# EAGLE schematic 7seg247 (EAGLE 6.6.0)
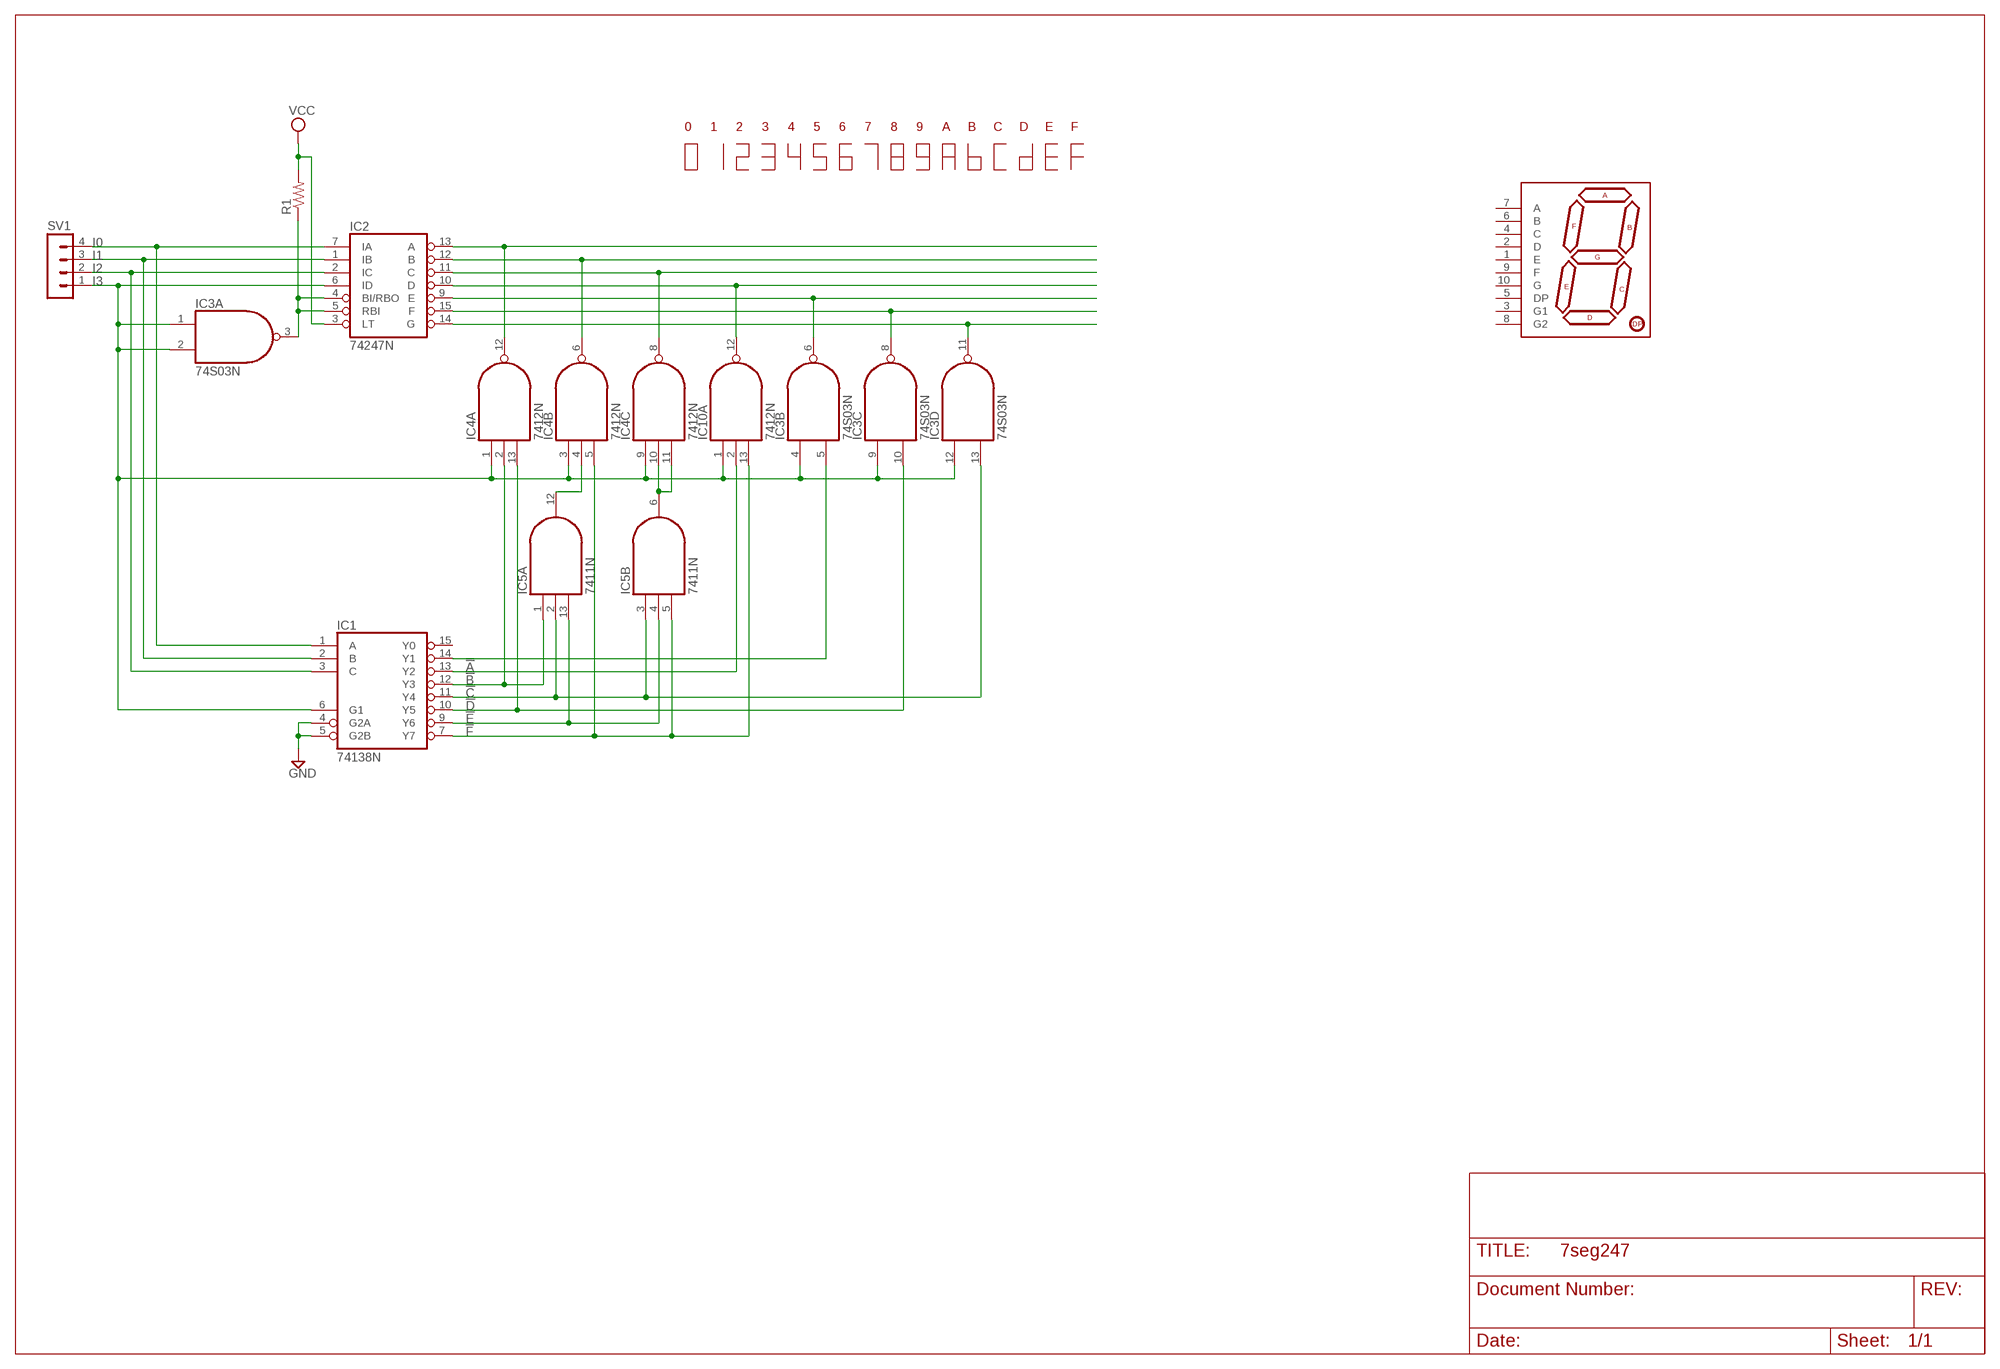
[diagram p0: schematic, sheet 1]

## Parts
IC1  74138N  74S138N  [DIL16]
IC2  74247N  7446N  [DIL16]
IC3  74S03N  [DIL14]
IC4  7412N  [DIL14]
IC5  7411N  74S11N  [DIL14]
IC10  7412N  [DIL14]
R1  R-US_0207/10  [0207/10]
SV1  MA04-1  [MA04-1]
U$1  7-SEGMENT-DISPLAY-1"-RED  [7-SEGMENT-1"PTH]

## Nets
!A: IC1.13(Y2) IC10.2(A:I1)
!B: IC1.12(Y3) IC4.2(A:I1) IC5.1(A:I0)
!C: IC1.11(Y4) IC3.13(D:I1) IC5.2(A:I1) IC5.3(B:I0)
!D: IC1.10(Y5) IC3.10(C:I1) IC4.13(A:I2)
!E: IC1.9(Y6) IC5.4(B:I1) IC5.13(A:I2)
!F: IC1.7(Y7) IC4.5(B:I2) IC5.5(B:I2) IC10.13(A:I2)
GND: IC1.4(G2A) IC1.5(G2B)
I0: IC1.1(A) IC2.7(IA) SV1.4
I1: IC1.2(B) IC2.1(IB) SV1.3
I2: IC1.3(C) IC2.2(IC) SV1.2
I3: IC1.6(G1) IC2.6(ID) IC3.1(A:I0) IC3.2(A:I1) IC3.4(B:I0) IC3.9(C:I0) IC3.12(D:I0) IC4.1(A:I0) IC4.3(B:I0) IC4.9(C:I0) IC10.1(A:I0) SV1.1
N$1: IC2.4(BI/RBO) IC2.5(RBI) IC3.3(A:O) R1.1
N$2: IC4.4(B:I1) IC5.12(A:O)
N$3: IC4.10(C:I1) IC4.11(C:I2) IC5.6(B:O)
N$4: IC2.13(A) IC4.12(A:O)
N$5: IC1.14(Y1) IC3.5(B:I1)
N$6: IC2.11(C) IC4.8(C:O)
N$7: IC2.10(D) IC10.12(A:O)
N$8: IC2.9(E) IC3.6(B:O)
N$9: IC2.15(F) IC3.8(C:O)
N$10: IC2.14(G) IC3.11(D:O)
N$11: IC2.12(B) IC4.6(B:O)
VCC: IC2.3(LT) R1.2
Unconnected: IC1.15(Y0) IC5.8(C:O) IC5.9(C:I0) IC5.10(C:I1) IC5.11(C:I2) IC10.3(B:I0) IC10.4(B:I1) IC10.5(B:I2) IC10.6(B:O) IC10.8(C:O) IC10.9(C:I0) IC10.10(C:I1) IC10.11(C:I2) U$1.1(E) U$1.2(D) U$1.3(G1) U$1.4(C) U$1.5(DP) U$1.6(B) U$1.7(A) U$1.8(G2) U$1.9(F) U$1.10(G)

## Notes on the sheet
- 0 | 1 | 2 | 3 | 4 | 5 | 6 | 7 | 8 | 9 | A | B | C | D | E | F

## Power pins joined to a net without a drawn wire
GND: IC1.8(GND) IC2.8(GND) IC3.7(P:GND) IC4.7(P:GND) IC5.7(P:GND) IC10.7(P:GND)
VCC: IC1.16(VCC) IC2.16(VCC) IC3.14(P:VCC) IC4.14(P:VCC) IC5.14(P:VCC) IC10.14(P:VCC)

## Library data of the parts
IC1 = 74xx-us:74*138: 3-line to 8-line DECODER/DEMULTIPLEXER
IC2 = 74xx-us:74*46: BCD to seven segment DECODER/DRIVER, open collector
IC3 = 74xx-us:74*03: Quad 2-input NAND gate, open collector output
IC4 IC10 = 74xx-us:74*12: Triple 3-input NAND gate, open collector
IC5 = 74xx-us:74*11: Triple 3-input AND gate
R1 = rcl:R-US_: RESISTOR, American symbol
SV1 = con-lstb:MA04-1: PIN HEADER; OC_FARNELL: unknown; OC_NEWARK: unknown
U$1 = SparkFun5:7-SEGMENT-DISPLAY-1"-RED: 7-Segment Display 1" Red (COM-08546)